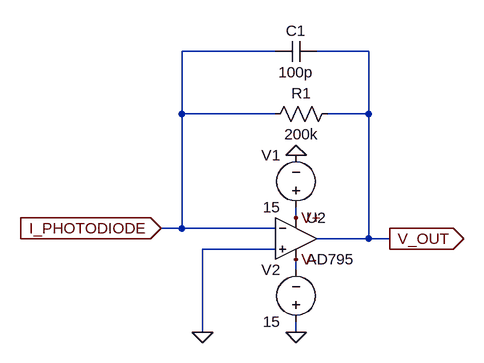
[diagram p0: schematic photodiode_model_TIA.asc]
photodiode_model_TIA.asc, the LTspice schematic file:
Version 4.1
SHEET 1 880 680
WIRE 112 -208 -32 -208
WIRE 256 -208 176 -208
WIRE -32 -112 -32 -208
WIRE 112 -112 -32 -112
WIRE 256 -112 256 -208
WIRE 256 -112 192 -112
WIRE 144 48 144 32
WIRE -32 64 -32 -112
WIRE -32 64 -64 64
WIRE 112 64 -32 64
WIRE 256 80 256 -112
WIRE 256 80 176 80
WIRE 288 80 256 80
WIRE 112 96 0 96
WIRE 144 128 144 112
WIRE 0 224 0 96
WIRE 144 224 144 208
FLAG 0 224 0
FLAG -64 64 I_PHOTODIODE
IOPIN -64 64 In
FLAG 144 48 V+
FLAG 144 112 V-
FLAG 288 80 V_OUT
IOPIN 288 80 Out
FLAG 144 -48 0
FLAG 144 224 0
SYMBOL res 96 -96 R270
WINDOW 0 32 56 VTop 2
WINDOW 3 0 56 VBottom 2
SYMATTR InstName R1
SYMATTR Value 200k
SYMBOL OpAmps\\AD795 144 16 R0
SYMATTR InstName U2
SYMBOL cap 176 -224 R90
WINDOW 0 0 32 VBottom 2
WINDOW 3 32 32 VTop 2
SYMATTR InstName C1
SYMATTR Value 100p
SYMBOL voltage 144 48 R180
WINDOW 0 24 96 Left 2
WINDOW 3 24 16 Left 2
WINDOW 123 0 0 Left 0
WINDOW 39 0 0 Left 0
SYMATTR InstName V1
SYMATTR Value 15
SYMBOL voltage 144 224 R180
WINDOW 0 24 96 Left 2
WINDOW 3 24 16 Left 2
WINDOW 123 0 0 Left 0
WINDOW 39 0 0 Left 0
SYMATTR InstName V2
SYMATTR Value 15

The netlist it stands for:
* photodiode_model_TIA.asc
R1 I_PHOTODIODE V_OUT 200k
X§U2 0 I_PHOTODIODE V+ V- V_OUT AD795  ; pins In+ In- V+ V- OUT
C1 V_OUT I_PHOTODIODE 100p
V1 V+ 0 15
V2 0 V- 15
.lib ADI1.lib
.backanno
.end